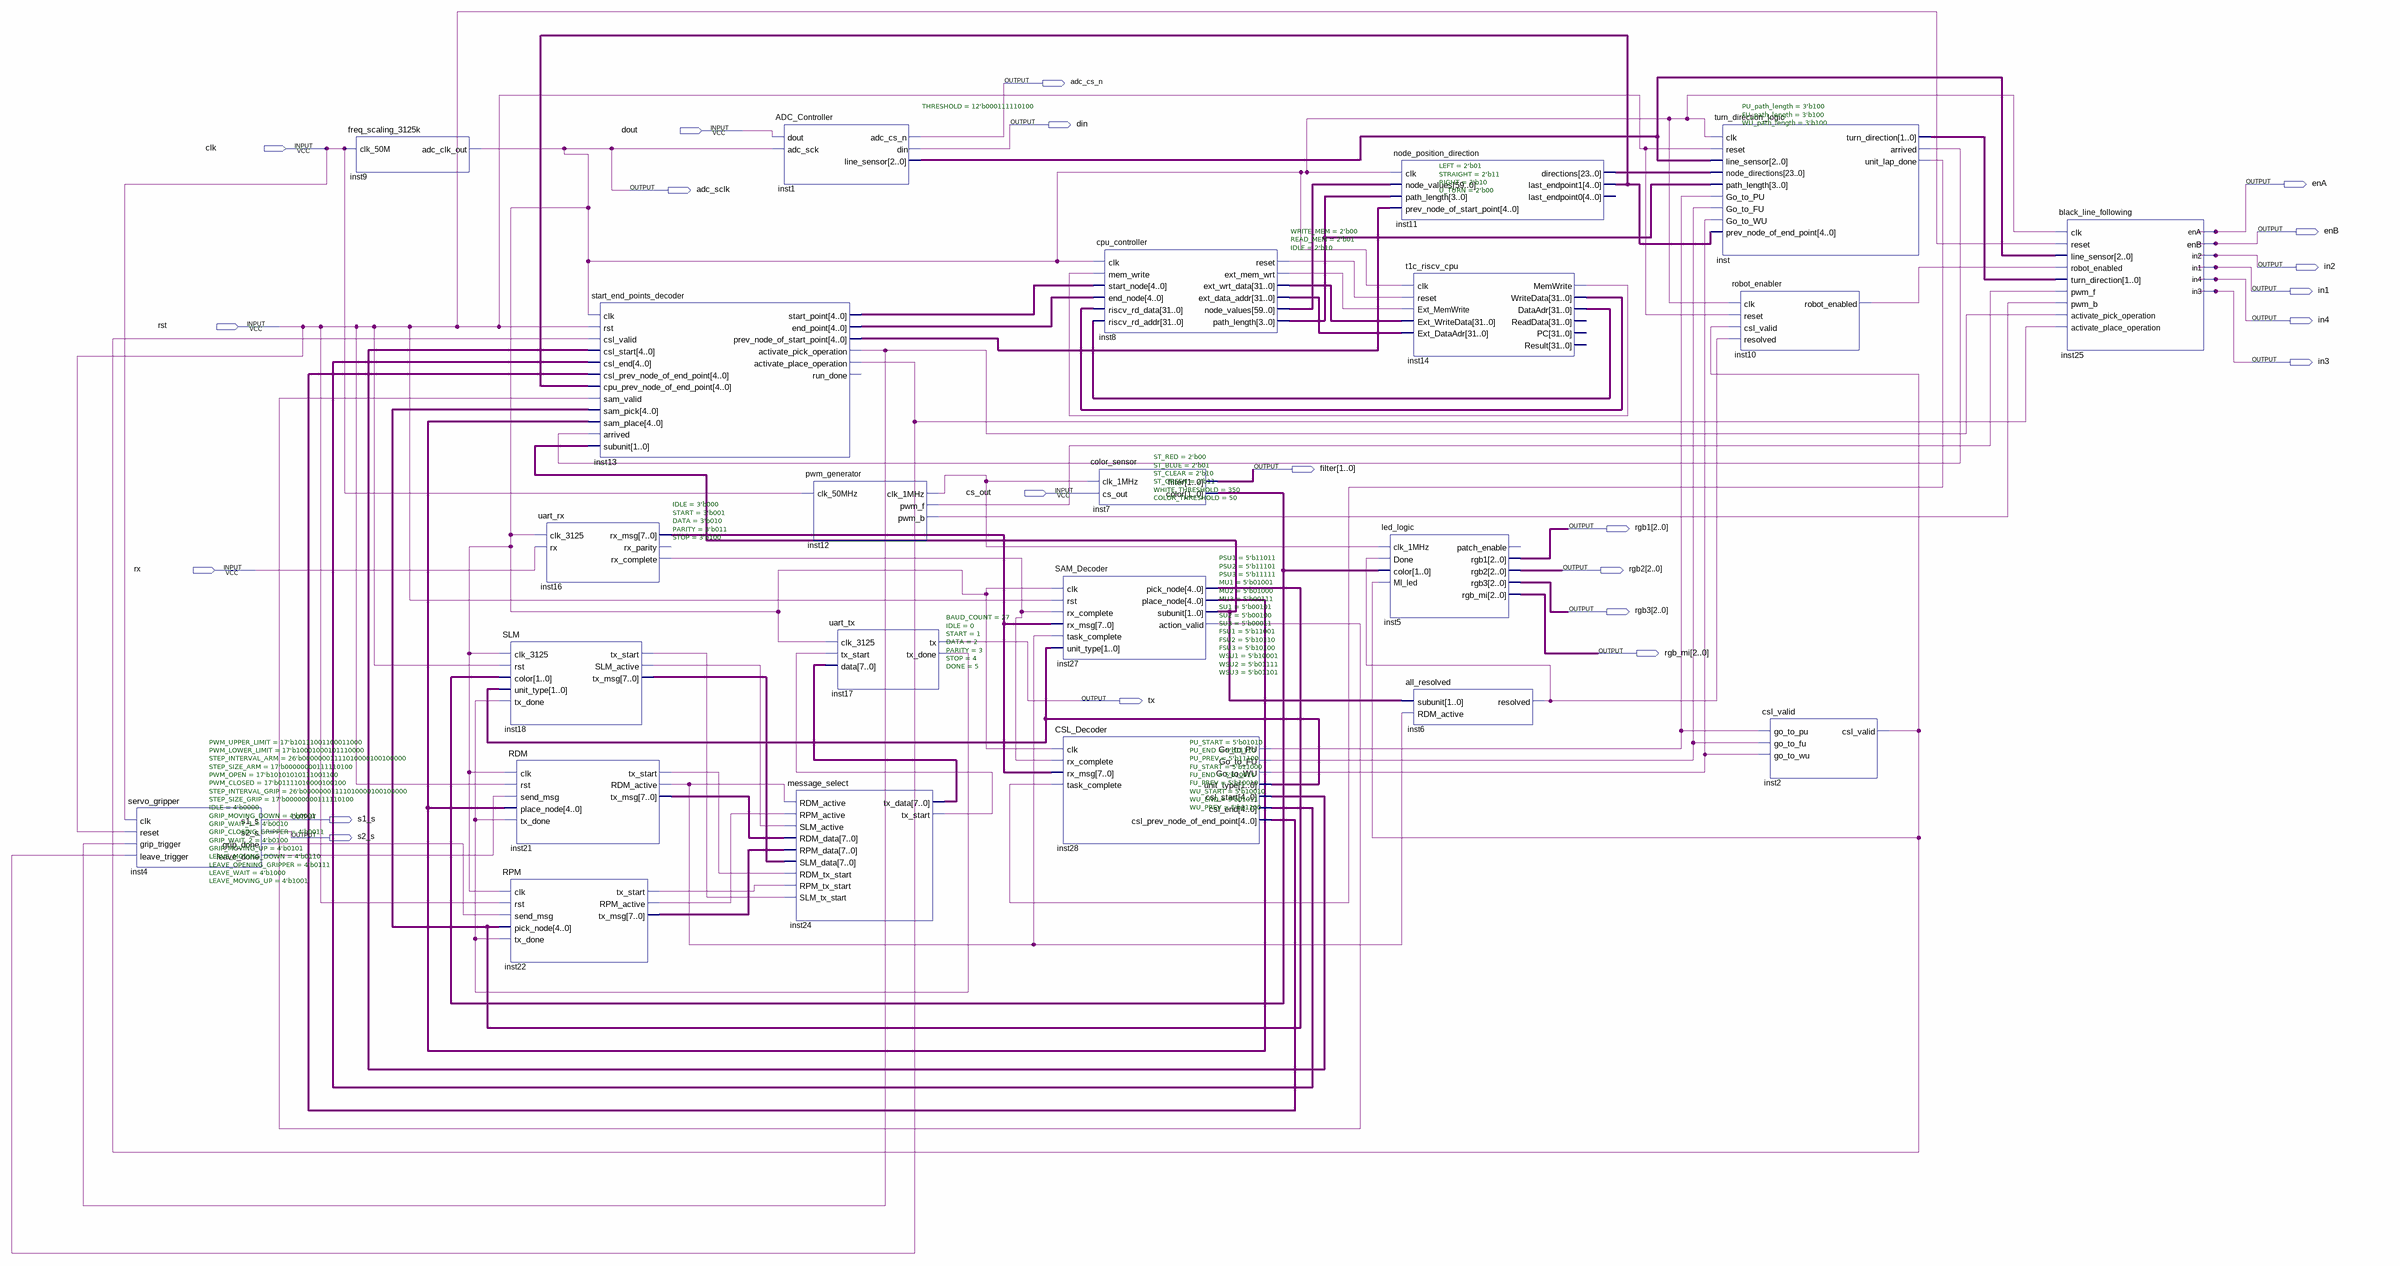
[diagram p0: schematic sheet]
// Quartus schematic eb_controller_top_module.bdf as structural Verilog: 23 symbols, 22 pins
module eb_controller_top_module (
  input  dout,
  input  clk,
  input  rst,
  input  cs_out,
  input  rx,
  output adc_cs_n,
  output din,
  output enA,
  output adc_sclk,
  output enB,
  output in2,
  output in1,
  output in4,
  output in3,
  output [1:0] filter,
  output [2:0] rgb1,
  output [2:0] rgb2,
  output [2:0] rgb3,
  output [2:0] rgb_mi,
  output tx,
  output s1_s,
  output s2_s
);

  wire inst2_csl_valid, inst4_grip_done, inst4_leave_done, inst6_resolved, inst8_ext_mem_wrt, inst8_reset,
       inst10_robot_enabled, inst12_clk_1mhz, inst12_pwm_b, inst12_pwm_f, inst13_activate_pick_operation,
       inst13_activate_place_operation, inst14_memwrite, inst16_rx_complete, inst17_tx_done,
       inst18_slm_active, inst18_tx_start, inst21_rdm_active, inst21_tx_start, inst22_rpm_active,
       inst22_tx_start, inst24_tx_start, inst27_action_valid, inst28_go_to_fu, inst28_go_to_pu,
       inst28_go_to_wu, inst_arrived, inst_unit_lap_done;
  wire [1:0] inst7_color, inst27_subunit, inst28_unit_type, inst_turn_direction;
  wire [2:0] inst1_line_sensor;
  wire [3:0] inst8_path_length;
  wire [4:0] inst11_last_endpoint1, inst13_end_point, inst13_prev_node_of_start_point, inst13_start_point,
       inst27_pick_node, inst27_place_node, inst28_csl_end, inst28_csl_prev_node_of_end_point,
       inst28_csl_start;
  wire [7:0] inst16_rx_msg, inst18_tx_msg, inst21_tx_msg, inst22_tx_msg, inst24_tx_data;
  wire [23:0] inst11_directions;
  wire [31:0] inst8_ext_data_addr, inst8_ext_wrt_data, inst14_dataadr, inst14_writedata;
  wire [59:0] inst8_node_values;

  servo_gripper #(.PWM_UPPER_LIMIT(17'b10111001100011000), .PWM_LOWER_LIMIT(17'b10001000101110000), .STEP_INTERVAL_ARM(26'b00000001111010000100100000), .STEP_SIZE_ARM(17'b00000000111110100), .PWM_OPEN(17'b10101010111001100), .PWM_CLOSED(17'b01111010000100100), .STEP_INTERVAL_GRIP(26'b00000001111010000100100000), .STEP_SIZE_GRIP(17'b00000000111110100), .IDLE(4'b0000), .GRIP_MOVING_DOWN(4'b0001), .GRIP_WAIT_1(4'b0010), .GRIP_CLOSING_GRIPPER(4'b0011), .GRIP_WAIT_2(4'b0100), .GRIP_MOVING_UP(4'b0101), .LEAVE_MOVING_DOWN(4'b0110), .LEAVE_OPENING_GRIPPER(4'b0111), .LEAVE_WAIT(4'b1000), .LEAVE_MOVING_UP(4'b1001)) inst4 (
    .clk(clk), .reset(rst), .grip_trigger(inst13_activate_pick_operation),
    .leave_trigger(inst13_activate_place_operation), .s1_s(s1_s), .s2_s(s2_s), .grip_done(inst4_grip_done),
    .leave_done(inst4_leave_done));
  freq_scaling_3125k inst9 (.clk_50M(clk), .adc_clk_out(adc_sclk));
  SLM inst18 (
    .clk_3125(adc_sclk), .rst(rst), .color(inst7_color), .unit_type(inst28_unit_type),
    .tx_done(inst17_tx_done), .tx_start(inst18_tx_start), .SLM_active(inst18_slm_active),
    .tx_msg(inst18_tx_msg));
  RDM inst21 (
    .clk(adc_sclk), .rst(rst), .send_msg(inst4_leave_done), .place_node(inst27_place_node),
    .tx_done(inst17_tx_done), .tx_start(inst21_tx_start), .RDM_active(inst21_rdm_active),
    .tx_msg(inst21_tx_msg));
  RPM inst22 (
    .clk(adc_sclk), .rst(rst), .send_msg(inst4_grip_done), .pick_node(inst27_pick_node),
    .tx_done(inst17_tx_done), .tx_start(inst22_tx_start), .RPM_active(inst22_rpm_active),
    .tx_msg(inst22_tx_msg));
  uart_rx #(.IDLE(3'b000), .START(3'b001), .DATA(3'b010), .PARITY(3'b011), .STOP(3'b100)) inst16 (
    .clk_3125(adc_sclk), .rx(rx), .rx_msg(inst16_rx_msg), .rx_complete(inst16_rx_complete));  // open: rx_parity
  start_end_points_decoder inst13 (
    .clk(adc_sclk), .rst(rst), .csl_valid(inst2_csl_valid), .csl_start(inst28_csl_start),
    .csl_end(inst28_csl_end), .csl_prev_node_of_end_point(inst28_csl_prev_node_of_end_point),
    .cpu_prev_node_of_end_point(inst11_last_endpoint1), .sam_valid(inst27_action_valid),
    .sam_pick(inst27_pick_node), .sam_place(inst27_place_node), .arrived(inst_arrived),
    .subunit(inst27_subunit), .start_point(inst13_start_point), .end_point(inst13_end_point),
    .prev_node_of_start_point(inst13_prev_node_of_start_point),
    .activate_pick_operation(inst13_activate_pick_operation),
    .activate_place_operation(inst13_activate_place_operation));  // open: run_done
  ADC_Controller #(.THRESHOLD(12'b000111110100)) inst1 (
    .dout(dout), .adc_sck(adc_sclk), .adc_cs_n(adc_cs_n), .din(din), .line_sensor(inst1_line_sensor));
  pwm_generator inst12 (.clk_50MHz(clk), .clk_1MHz(inst12_clk_1mhz), .pwm_f(inst12_pwm_f), .pwm_b(inst12_pwm_b));
  message_select inst24 (
    .RDM_active(inst21_rdm_active), .RPM_active(inst22_rpm_active), .SLM_active(inst18_slm_active),
    .RDM_data(inst21_tx_msg), .RPM_data(inst22_tx_msg), .SLM_data(inst18_tx_msg),
    .RDM_tx_start(inst21_tx_start), .RPM_tx_start(inst22_tx_start), .SLM_tx_start(inst18_tx_start),
    .tx_data(inst24_tx_data), .tx_start(inst24_tx_start));
  uart_tx #(.BAUD_COUNT(27), .IDLE(0), .START(1), .DATA(2), .PARITY(3), .STOP(4), .DONE(5)) inst17 (
    .clk_3125(adc_sclk), .tx_start(inst24_tx_start), .data(inst24_tx_data), .tx(tx), .tx_done(inst17_tx_done));
  SAM_Decoder #(.PSU1(5'b11011), .PSU2(5'b11101), .PSU3(5'b11111), .MU1(5'b01001), .MU2(5'b01000), .MU3(5'b00111), .SU1(5'b00101), .SU2(5'b00100), .SU3(5'b00011), .FSU1(5'b11001), .FSU2(5'b10110), .FSU3(5'b10100), .WSU1(5'b10001), .WSU2(5'b01111), .WSU3(5'b01101)) inst27 (
    .clk(adc_sclk), .rst(rst), .rx_complete(inst16_rx_complete), .rx_msg(inst16_rx_msg),
    .task_complete(inst21_rdm_active), .unit_type(inst28_unit_type), .pick_node(inst27_pick_node),
    .place_node(inst27_place_node), .subunit(inst27_subunit), .action_valid(inst27_action_valid));
  CSL_Decoder #(.PU_START(5'b01010), .PU_END(5'b11110), .PU_PREV(5'b11100), .FU_START(5'b11000), .FU_END(5'b10011), .FU_PREV(5'b10010), .WU_START(5'b10010), .WU_END(5'b01011), .WU_PREV(5'b01100)) inst28 (
    .clk(adc_sclk), .rx_complete(inst16_rx_complete), .rx_msg(inst16_rx_msg),
    .task_complete(inst_unit_lap_done), .Go_to_PU(inst28_go_to_pu), .Go_to_FU(inst28_go_to_fu),
    .Go_to_WU(inst28_go_to_wu), .unit_type(inst28_unit_type), .csl_start(inst28_csl_start),
    .csl_end(inst28_csl_end), .csl_prev_node_of_end_point(inst28_csl_prev_node_of_end_point));
  cpu_controller #(.WRITE_MEM(2'b00), .READ_MEM(2'b01), .IDLE(2'b10)) inst8 (
    .clk(adc_sclk), .mem_write(inst14_memwrite), .start_node(inst13_start_point),
    .end_node(inst13_end_point), .riscv_rd_data(inst14_writedata), .riscv_rd_addr(inst14_dataadr),
    .reset(inst8_reset), .ext_mem_wrt(inst8_ext_mem_wrt), .ext_wrt_data(inst8_ext_wrt_data),
    .ext_data_addr(inst8_ext_data_addr), .node_values(inst8_node_values), .path_length(inst8_path_length));
  color_sensor #(.ST_RED(2'b00), .ST_BLUE(2'b01), .ST_CLEAR(2'b10), .ST_GREEN(2'b11), .WHITE_THRESHOLD(350), .COLOR_THRESHOLD(50)) inst7 (
    .clk_1MHz(inst12_clk_1mhz), .cs_out(cs_out), .filter(filter), .color(inst7_color));
  led_logic inst5 (
    .clk_1MHz(inst12_clk_1mhz), .Done(inst6_resolved), .color(inst7_color), .MI_led(inst2_csl_valid),
    .rgb1(rgb1), .rgb2(rgb2), .rgb3(rgb3), .rgb_mi(rgb_mi));  // open: patch_enable
  node_position_direction #(.LEFT(2'b01), .STRAIGHT(2'b11), .RIGHT(2'b10), .U_TURN(2'b00)) inst11 (
    .clk(adc_sclk), .node_values(inst8_node_values), .path_length(inst8_path_length),
    .prev_node_of_start_point(inst13_prev_node_of_start_point), .directions(inst11_directions),
    .last_endpoint1(inst11_last_endpoint1));  // open: last_endpoint0
  t1c_riscv_cpu inst14 (
    .clk(adc_sclk), .reset(inst8_reset), .Ext_MemWrite(inst8_ext_mem_wrt),
    .Ext_WriteData(inst8_ext_wrt_data), .Ext_DataAdr(inst8_ext_data_addr), .MemWrite(inst14_memwrite),
    .WriteData(inst14_writedata), .DataAdr(inst14_dataadr));  // open: ReadData, PC, Result
  all_resolved inst6 (.subunit(inst27_subunit), .RDM_active(inst21_rdm_active), .resolved(inst6_resolved));
  turn_direction_logic #(.PU_path_length(3'b100), .FU_path_length(3'b100), .WU_path_length(3'b100)) inst (
    .clk(adc_sclk), .reset(rst), .line_sensor(inst1_line_sensor), .node_directions(inst11_directions),
    .path_length(inst8_path_length), .Go_to_PU(inst28_go_to_pu), .Go_to_FU(inst28_go_to_fu),
    .Go_to_WU(inst28_go_to_wu), .prev_node_of_end_point(inst11_last_endpoint1),
    .turn_direction(inst_turn_direction), .arrived(inst_arrived), .unit_lap_done(inst_unit_lap_done));
  robot_enabler inst10 (
    .clk(adc_sclk), .reset(rst), .csl_valid(inst2_csl_valid), .resolved(inst6_resolved),
    .robot_enabled(inst10_robot_enabled));
  csl_valid inst2 (
    .go_to_pu(inst28_go_to_pu), .go_to_fu(inst28_go_to_fu), .go_to_wu(inst28_go_to_wu),
    .csl_valid(inst2_csl_valid));
  black_line_following inst25 (
    .clk(adc_sclk), .reset(rst), .line_sensor(inst1_line_sensor), .robot_enabled(inst10_robot_enabled),
    .turn_direction(inst_turn_direction), .pwm_f(inst12_pwm_f), .pwm_b(inst12_pwm_b),
    .activate_pick_operation(inst13_activate_pick_operation),
    .activate_place_operation(inst13_activate_place_operation), .enA(enA), .enB(enB), .in2(in2), .in1(in1),
    .in4(in4), .in3(in3));
endmodule
